# EAGLE design Variateur.sch (EAGLE 6.1)
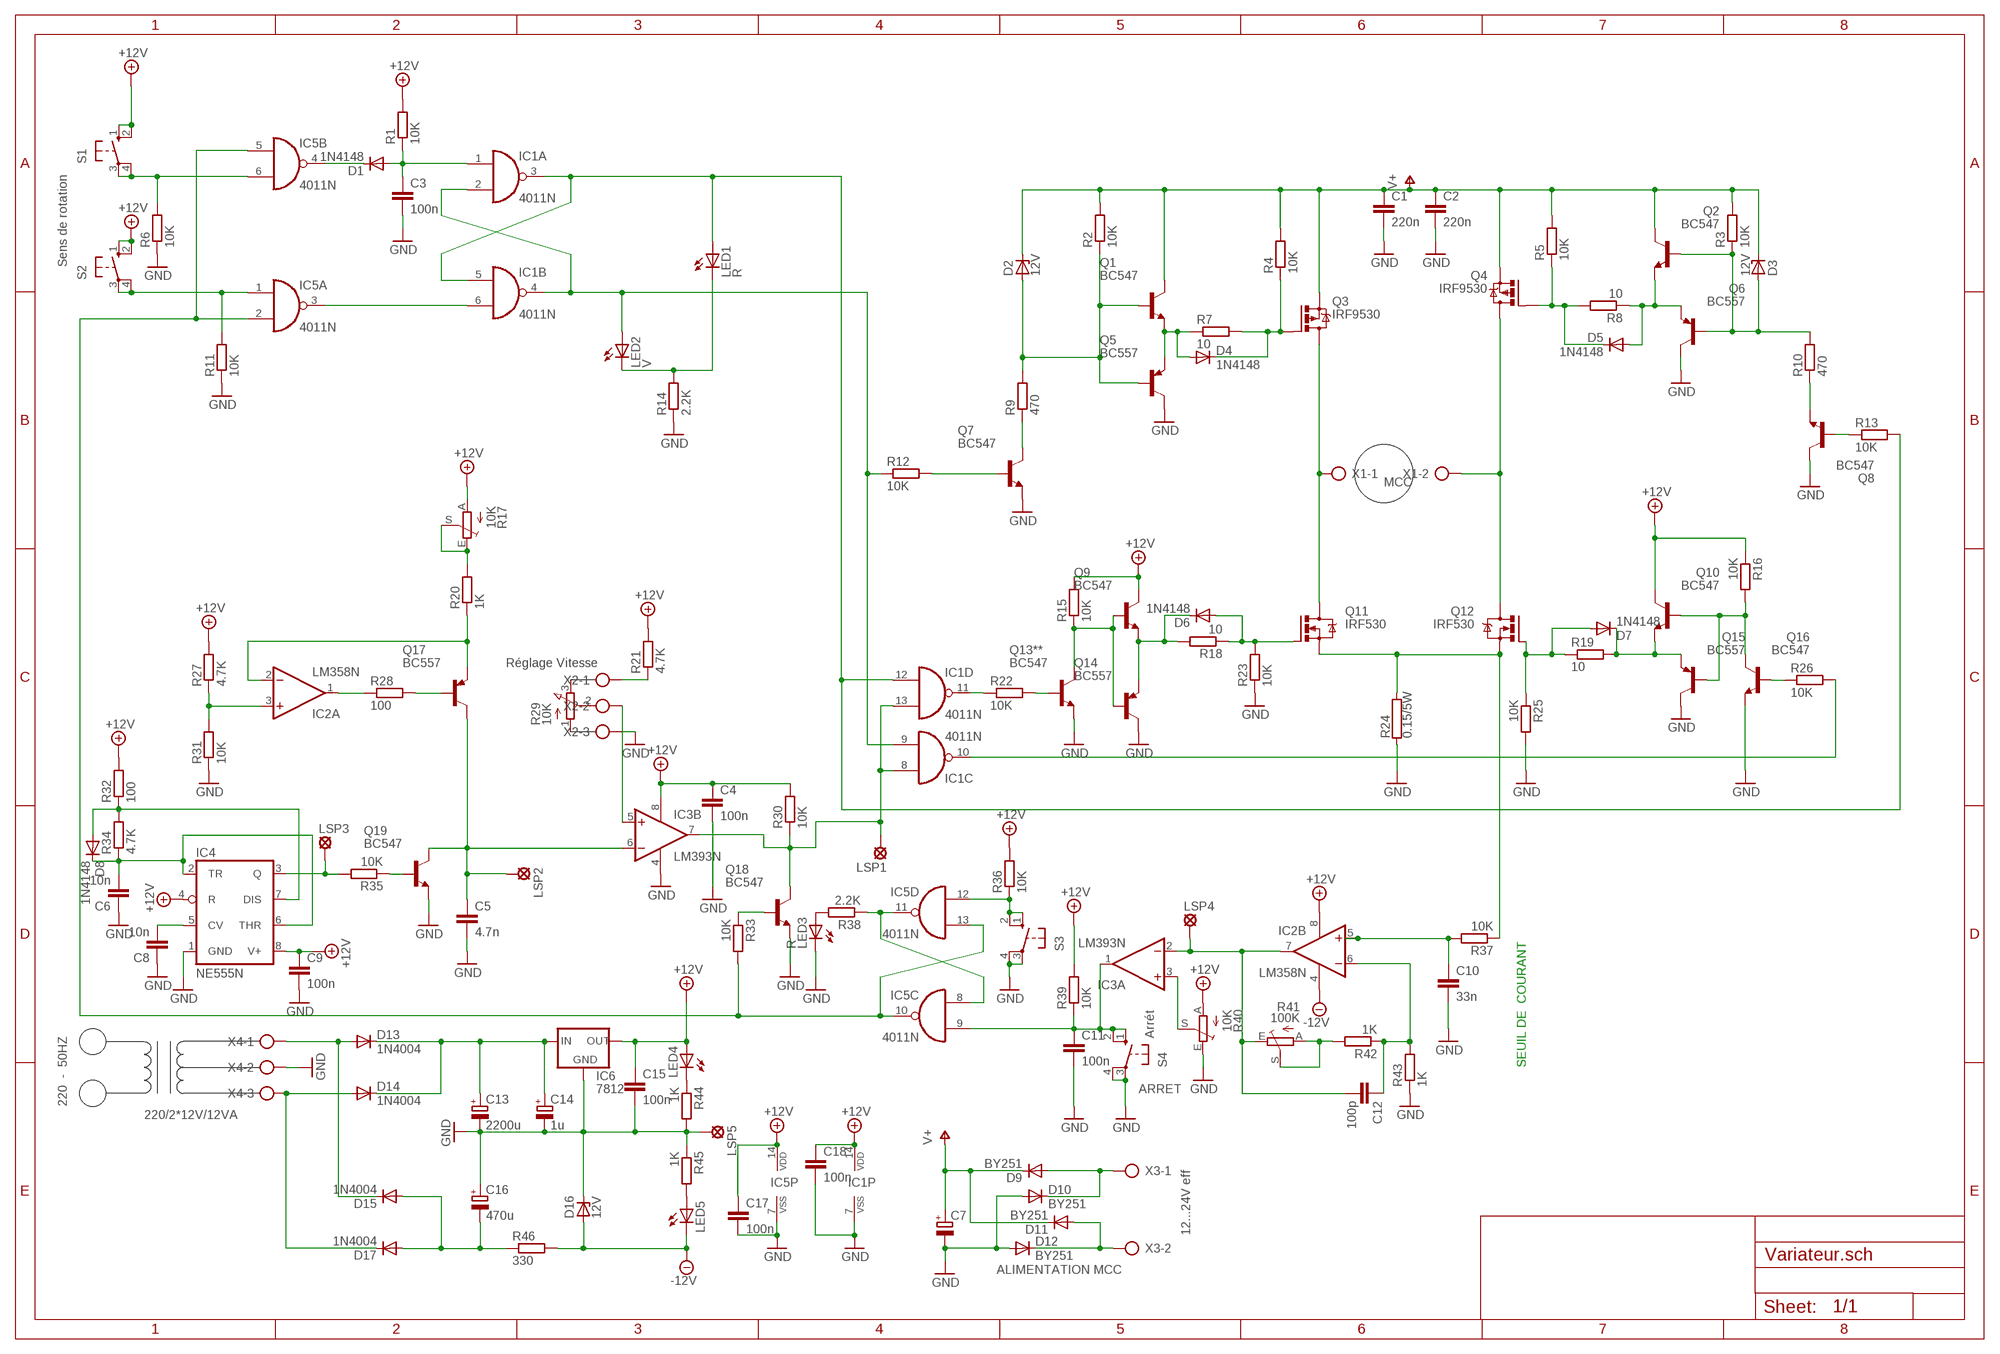
[diagram p0: schematic, sheet 1]

## Parts
C1  220n  C-EU150-064X183  [C150-064X183]
C2  220n  C-EU150-064X183  [C150-064X183]
C3  100n  C-EU050-035X075  [C050-035X075]
C4  100n  C-EU050-035X075  [C050-035X075]
C5  4.7n  C-EU050-035X075  [C050-035X075]
C6  10n  C-EU050-035X075  [C050-035X075]
C7  CPOL-EUE10-25  [EB25D]
C8  10n  C-EU050-035X075  [C050-035X075]
C9  100n  C-EU050-035X075  [C050-035X075]
C10  33n  C-EU050-035X075  [C050-035X075]
C11  100n  C-EU050-035X075  [C050-035X075]
C12  100p  C-EU050-035X075  [C050-035X075]
C13  2200u  CPOL-EUE5-13  [E5-13]
C14  1u  CPOL-EUE2.5-6  [E2,5-6]
C15  100n  C-EU050-035X075  [C050-035X075]
C16  470u  CPOL-EUE3.5-10  [E3,5-10]
C17  100n  C-EU050-035X075  [C050-035X075]
C18  100n  C-EU050-035X075  [C050-035X075]
D1  1N4148  1N4148DO35-10  [DO35-10]
D2  12V  BZX85  [DO41Z10]
D3  12V  BZX85  [DO41Z10]
D4  1N4148  1N4148DO35-10  [DO35-10]
D5  1N4148  1N4148DO35-10  [DO35-10]
D6  1N4148  1N4148DO35-10  [DO35-10]
D7  1N4148  1N4148DO35-10  [DO35-10]
D8  1N4148  1N4148DO35-10  [DO35-10]
D9  BY251  [DO201-15]
D10  BY251  [DO201-15]
D11  BY251  [DO201-15]
D12  BY251  [DO201-15]
D13  1N4004  [DO41-10]
D14  1N4004  [DO41-10]
D15  1N4004  [DO41-10]
D16  12V  BZX85  [DO41Z10]
D17  1N4004  [DO41-10]
IC1  4011N  [DIL14]
IC2  LM358N  [DIL08]
IC3  LM393N  [DIL08]
IC4  NE555N  [DIL08]
IC5  4011N  [DIL14]
IC6  7812  78XXS  [78XXS]
LED1  R  LED5MM  [LED5MM]
LED2  V  LED5MM  [LED5MM]
LED3  R  LED5MM  [LED5MM]
LED4  LED5MM  [LED5MM]
LED5  LED5MM  [LED5MM]
LSP1  LSP10  [LSP10]
LSP2  LSP10  [LSP10]
LSP3  LSP10  [LSP10]
LSP4  LSP10  [LSP10]
LSP5  LSP10  [LSP10]
Q1  BC547  [TO92]
Q2  BC547  [TO92]
Q3  IRF9530  [TO220BV]
Q4  IRF9530  [TO220BV]
Q5  BC557  [TO92-EBC]
Q6  BC557  [TO92]
Q7  BC547  [TO92]
Q8  BC547  [TO92]
Q9  BC547  [TO92]
Q10  BC547  [TO92]
Q11  IRF530  [TO220BV]
Q12  IRF530  [TO220BV]
Q13**  BC547  [TO92]
Q14  BC557  [TO92-EBC]
Q15  BC557  [TO92]
Q16  BC547  [TO92]
Q17  BC557  MPSA56-TO92  [TO92-CBE]
Q18  BC547  -NPN-TO92  [TO92]
Q19  BC547  -NPN-TO92  [TO92]
R1  10K  R-EU_0207/10  [0207/10]
R2  10K  R-EU_0207/10  [0207/10]
R3  10K  R-EU_0207/10  [0207/10]
R4  10K  R-EU_0207/10  [0207/10]
R5  10K  R-EU_0207/10  [0207/10]
R6  10K  R-EU_0207/10  [0207/10]
R7  10  R-EU_0207/10  [0207/10]
R8  10  R-EU_0207/10  [0207/10]
R9  470  R-EU_0207/10  [0207/10]
R10  470  R-EU_0207/10  [0207/10]
R11  10K  R-EU_0207/10  [0207/10]
R12  10K  R-EU_0207/15  [0207/15]
R13  10K  R-EU_0207/15  [0207/15]
R14  2.2K  R-EU_0207/15  [0207/15]
R15  10K  R-EU_0207/15  [0207/15]
R16  10K  R-EU_0207/10  [0207/10]
R17  10K  TRIM_EU-LI10  [LI10]
R18  10  R-EU_0207/10  [0207/10]
R19  10  R-EU_0207/10  [0207/10]
R20  1K  R-EU_0207/10  [0207/10]
R21  4.7K  R-EU_0207/10  [0207/10]
R22  10K  R-EU_0207/15  [0207/15]
R23  10K  R-EU_0207/10  [0207/10]
R24  0.15/5W  RHPS923  [HPS923]
R25  10K  R-EU_0207/10  [0207/10]
R26  10K  R-EU_0207/15  [0207/15]
R27  4.7K  R-EU_0207/10  [0207/10]
R28  100  R-EU_0207/10  [0207/10]
R29  10K  3RP/1610N  [3RP/1610N]
R30  10K  R-EU_0207/10  [0207/10]
R31  10K  R-EU_0207/10  [0207/10]
R32  100  R-EU_0207/10  [0207/10]
R33  10K  R-EU_0207/10  [0207/10]
R34  4.7K  R-EU_0207/10  [0207/10]
R35  10K  R-EU_0207/10  [0207/10]
R36  10K  R-EU_0207/10  [0207/10]
R37  10K  R-EU_0207/10  [0207/10]
R38  2.2K  R-EU_0207/10  [0207/10]
R39  10K  R-EU_0207/10  [0207/10]
R40  10K  TRIM_EU-LI10  [LI10]
R41  100K  TRIM_EU-LI10  [LI10]
R42  1K  R-EU_0207/10  [0207/10]
R43  1K  R-EU_0207/10  [0207/10]
R44  1K  R-EU_0207/10  [0207/10]
R45  1K  R-EU_0207/10  [0207/10]
R46  330  R-EU_0207/10  [0207/10]
S1  40-XX  [B3F-40XX]
S2  40-XX  [B3F-40XX]
S3  40-XX  [B3F-40XX]
S4  Arrét  40-XX  [B3F-40XX]
X1  AK300/2  [AK300/2]
X2  AK300/3  [AK300/3]
X3  AK300/2  [AK300/2]
X4  AK300/3  [AK300/3]

## Nets
+12V: C4.1 C9.1 C15.1 C17.1 C18.1 IC1.14(P:VDD) IC2.8(P:V+) IC3.8(P:V+) IC4.4(R) IC4.8(V+) IC5.14(P:VDD) IC6.OUT LED4.A Q9.3(C) Q10.3(C) R1.2 R15.2 R16.1 R17.A R21.2 R27.2 R30.2 R32.2 R36.2 R39.2 R40.A S1.1(S) S1.2(S1) S2.1(S) S2.2(S1)
-12V: D16.A IC2.4(P:V-) LED5.K(C) R46.2
D12: D11.A D12.C X3.2
GND: C1.2 C2.2 C3.2 C4.2 C5.2 C6.1 C7.- C8.1 C9.2 C10.2 C11.2 C13.- C14.- C15.2 C16.+ C17.2 C18.2 D10.A D12.A D16.C IC1.7(P:VSS) IC3.4(P:V-) IC4.1(GND) IC5.7(P:VSS) IC6.GND LED3.K(C) LSP5.MP Q5.C Q6.3(C) Q7.1(E) Q8.3(C) Q13**.1(E) Q14.C Q15.3(C) Q16.1(E) Q18.1(E) Q19.1(E) R6.1 R11.1 R14.1 R23.1 R24.1 R25.2 R31.1 R40.E R43.1 R44.2 R45.1 S3.3(P) S3.4(P1) S4.3(P) S4.4(P1) X2.3 X4.2
N$1: C8.2 IC4.5(CV)
N$2: D7.A Q12.G R19.1 R25.1
N$3: Q11.S Q12.S R24.2 R37.1
N$4: Q19.2(B) R35.1
N$5: D8.A IC4.7(DIS) R32.1 R34.2
N$6: D13.A D15.C X4.1
N$7: D14.A D17.C X4.3
N$8: LED4.K(C) R44.1
N$9: C6.2 D8.C IC4.2(TR) IC4.6(THR) R34.1
N$10: C13.+ C14.+ D13.C D14.C IC6.IN
N$12: C16.- D15.A D17.A R46.1
N$13: LED5.A R45.2
N$14: C5.1 IC3.6(B:-IN) LSP2.MP Q17.C Q19.3(C)
N$15: IC5.8(C:I0) IC5.11(D:O) R38.1
N$16: C12.2 IC2.7(B:OUT) IC3.2(A:-IN) LSP4.MP R41.E
N$17: R41.A R41.S R42.2
N$18: IC4.3(Q) LSP3.MP R35.2
N$19: R17.E R17.S R20.2
N$20: Q17.B R28.2
N$21: IC2.1(A:OUT) R28.1
N$22: IC2.3(A:+IN) R27.1 R31.2
N$23: LED3.A R38.2
N$24: IC2.2(A:-IN) Q17.E R20.1
N$25: IC5.2(A:I1) IC5.5(B:I0) IC5.10(C:O) IC5.13(D:I1) R33.2
N$27: IC3.5(B:+IN) X2.2
N$28: R21.1 X2.1
N$29: IC1.8(C:I0) IC1.13(D:I1) IC3.7(B:OUT) LSP1.MP Q18.3(C) R30.1
N$30: Q18.2(B) R33.1
N$31: IC5.12(D:I0) R36.1 S3.1(S) S3.2(S1)
N$33: C10.1 IC2.5(B:+IN) R37.2
N$34: C11.1 IC3.1(A:OUT) IC5.9(C:I1) R39.1 S4.1(S) S4.2(S1)
N$35: IC3.3(A:+IN) R40.S
N$37: Q8.1(E) R10.1
N$38: IC1.11(D:O) R22.1
N$39: Q13**.2(B) R22.2
N$40: IC1.10(C:O) R26.2
N$41: D6.C Q9.1(E) Q14.E R18.2
N$42: Q9.2(B) Q13**.3(C) Q14.B R15.1
N$43: D6.A Q11.G R18.1 R23.2
N$44: IC1.2(A:I1) IC1.4(B:O) IC1.9(C:I1) LED2.A R12.1
N$45: Q7.2(B) R12.2
N$46: Q7.3(C) R9.1
N$47: D2.A Q1.2(B) Q5.B R2.1 R9.2
N$48: D4.A Q1.1(E) Q5.E R7.1
N$50: Q3.D Q11.D X1.1
N$51: D4.C Q3.G R4.1 R7.2
N$57: Q4.D Q12.D X1.2
N$58: C12.1 IC2.6(B:-IN) R42.1 R43.2
N$59: D5.C Q4.G R5.1 R8.2
N$62: D7.C Q10.1(E) Q15.1(E) R19.2
N$63: Q16.2(B) R26.1
N$64: Q8.2(B) R13.1
N$65: IC1.3(A:O) IC1.5(B:I0) IC1.12(D:I0) LED1.A R13.2
N$66: Q10.2(B) Q15.2(B) Q16.3(C) R16.2
N$68: D3.A Q2.2(B) Q6.2(B) R3.1 R10.2
N$69: D5.A Q2.1(E) Q6.1(E) R8.1
N$71: LED1.K(C) LED2.K(C) R14.2
N$73: C3.1 D1.A IC1.1(A:I0) R1.1
N$74: IC1.6(B:I1) IC5.3(A:O)
N$75: D1.C IC5.4(B:O)
N$76: IC5.1(A:I0) R11.2 S2.3(P) S2.4(P1)
N$77: IC5.6(B:I1) R6.2 S1.3(P) S1.4(P1)
R: D9.A D10.C X3.1
V+: C1.1 C2.1 C7.+ D2.C D3.C D9.C D11.C Q1.3(C) Q2.3(C) Q3.S Q4.S R2.2 R3.2 R4.2 R5.2
Unconnected: R29.1(A) R29.2(S) R29.3(E)

## Notes on the sheet
- Sens de rotation
- MCC
- Réglage Vitesse
- SEUIL DE  COURANT
- ARRET
- 220  -  50HZ
- 220/2*12V/12VA
- 12...24V eff
- ALIMENTATION MCC

## Library data of the parts
C1-C4 C6 C8-C12 C15 C17 C18 = rcl:C-EU: CAPACITOR, European symbol
C5 = resistor:C-EU: CAPACITOR, European symbol
C7 C13 C14 C16 = rcl:CPOL-EU: POLARIZED CAPACITOR, European symbol
D1 D4-D8 = diode:1N4148: DIODE high speed (Philips)
D2 D3 D16 = diode:BZX85: Z DIODE
D9-D12 = diode:BY251: DIODE Si, 200 V, 3 A
D13-D15 D17 = diode:1N4004: DIODE general purpose rectifier, 1 A
IC1 IC5 = 40xx:4011: Quad 2-input NAND
IC2 = linear:LM358: OP AMP also LM158; LM258; LM2904 Source: http://cache.national.com/ds/LM/LM158.pdf
IC3 = linear:LM393: COMPARATOR
IC4 = linear:*555: TIMER
IC6 = v-reg:78XXS: VOLTAGE REGULATOR
LED1-LED5 = led:LED: LED OSRAM: - CHIPLED LG R971, LG N971, LY N971, LG Q971, LY Q971, LO R971, LY R971 LH N974, LH R974 LS Q976, LO Q976, LY Q976 LO Q996 - Hyper CHIPLED LW Q18S LB Q993, LB Q99A, LB R99A - SideLED LS A670, LO A670, LY A670, LG A670, LP A670 LB A673, LV A673, LT A673, LW A673 LH A674 LY A675 LS A676, LA A676, LO A676, LY A676, LW A676 LS A679, LY A679, LG A679 - Hyper Micro SIDELED® LS Y876, LA Y876, LO Y876, LY Y876 LT Y87S - SmartLED LW L88C, LW L88S LB L89C, LB L89S, LG L890 LS L89K, LO L89K, LY L89K LS L896, LA L896, LO L896, LY L896 - TOPLED LS T670, LO T670, LY T670, LG T670, LP T670 LSG T670, LSP T670, LSY T670, LOP T670, LYG T670 LG T671, LOG T671, LSG T671 LB T673, LV T673, LT T673, LW T673 LH T674 LS T676, LA T676, LO T676, LY T676, LB T676, LH T676, LSB T676, LW T676 LB T67C, LV T67C, LT T67C, LS T67K, LO T67K, LY T67K, LW E67C LS E67B, LA E67B, LO E67B, LY E67B, LB E67C, LV E67C, LT E67C LW T67C LS T679, LY T679, LG T679 LS T770, LO T770, LY T770, LG T770, LP T770 LB T773, LV T773, LT T773, LW T773 LH T774 LS E675, LA E675, LY E675, LS T675 LS T776, LA T776, LO T776, LY T776, LB T776 LHGB T686 LT T68C, LB T68C - Hyper Mini TOPLED® LB M676 - Mini TOPLED Santana® LG M470 LS M47K, LO M47K, LY M47K Source: http://www.osram.convergy.de LUXEON: - LUMILED® LXK2-PW12-R00, LXK2-PW12-S00, LXK2-PW14-U00, LXK2-PW14-V00 LXK2-PM12-R00, LXK2-PM12-S00, LXK2-PM14-U00 LXK2-PE12-Q00, LXK2-PE12-R00, LXK2-PE12-S00, LXK2-PE14-T00, LXK2-PE14-U00 LXK2-PB12-K00, LXK2-PB12-L00, LXK2-PB12-M00, LXK2-PB14-N00, LXK2-PB14-P00, LXK2-PB14-Q00 LXK2-PR12-L00, LXK2-PR12-M00, LXK2-PR14-Q00, LXK2-PR14-R00 LXK2-PD12-Q00, LXK2-PD12-R00, LXK2-PD12-S00 LXK2-PH12-R00, LXK2-PH12-S00 LXK2-PL12-P00, LXK2-PL12-Q00, LXK2-PL12-R00 Source: www.luxeon.com KINGBRIGHT: KA-3528ASYC Source: www.kingbright.com
LSP1-LSP5 = solpad:LSP10: SOLDER PAD drill 1.0 mm, distributor Buerklin, 12H555
Q1 Q2 Q7-Q9 Q13** = transistor-npn:BC547*: NPN Transistor
Q3 Q4 = transistor-power:IRF9530: P-CHANNEL HEXFET POWER-MOS-FET Source: http://www.irf.com/product-info/datasheets/data/irf9530.pdf
Q5 Q14 = transistor-pnp:BC557*: PNP Transistror
Q6 Q15 = transistor-pnp:BC557: PNP Transistor
Q10 Q16 = transistor-neu-to92:BC547: NPN TRANSISTOR
Q11 Q12 = transistor-power:IRF530: HEXFET Power MOSFET
Q17 = transistor-pnp:*-?: PNP Transistor
Q18 Q19 = transistor-neu-to92:*-NPN-: NPN Transistror
R1-R16 R18-R23 R25-R28 R30-R39 R42-R46 = rcl:R-EU_: RESISTOR, European symbol
R17 R40 R41 = pot:TRIM_EU-: POTENTIOMETER
R24 = resistor-power:R: Power Resitor; OC_FARNELL: unknown; OC_NEWARK: unknown
R29 = pot:3RP/1610N: 16mm Potentiometer one level Source: http://www.alphapotentiometers.net/html/16mm_pot_2.html
S1-S4 = switch-omron:40-XX: OMRON SWITCH; MF: OMRON COMPONENTS USA; MPN: B3F-4000; OC_FARNELL: 176434; OC_NEWARK: 36K3105
X1 X3 = con-ptr500:AK300/2: CONNECTOR; OC_FARNELL: unknown; OC_NEWARK: unknown
X2 X4 = con-ptr500:AK300/3: CONNECTOR; OC_FARNELL: unknown; OC_NEWARK: unknown

## Board
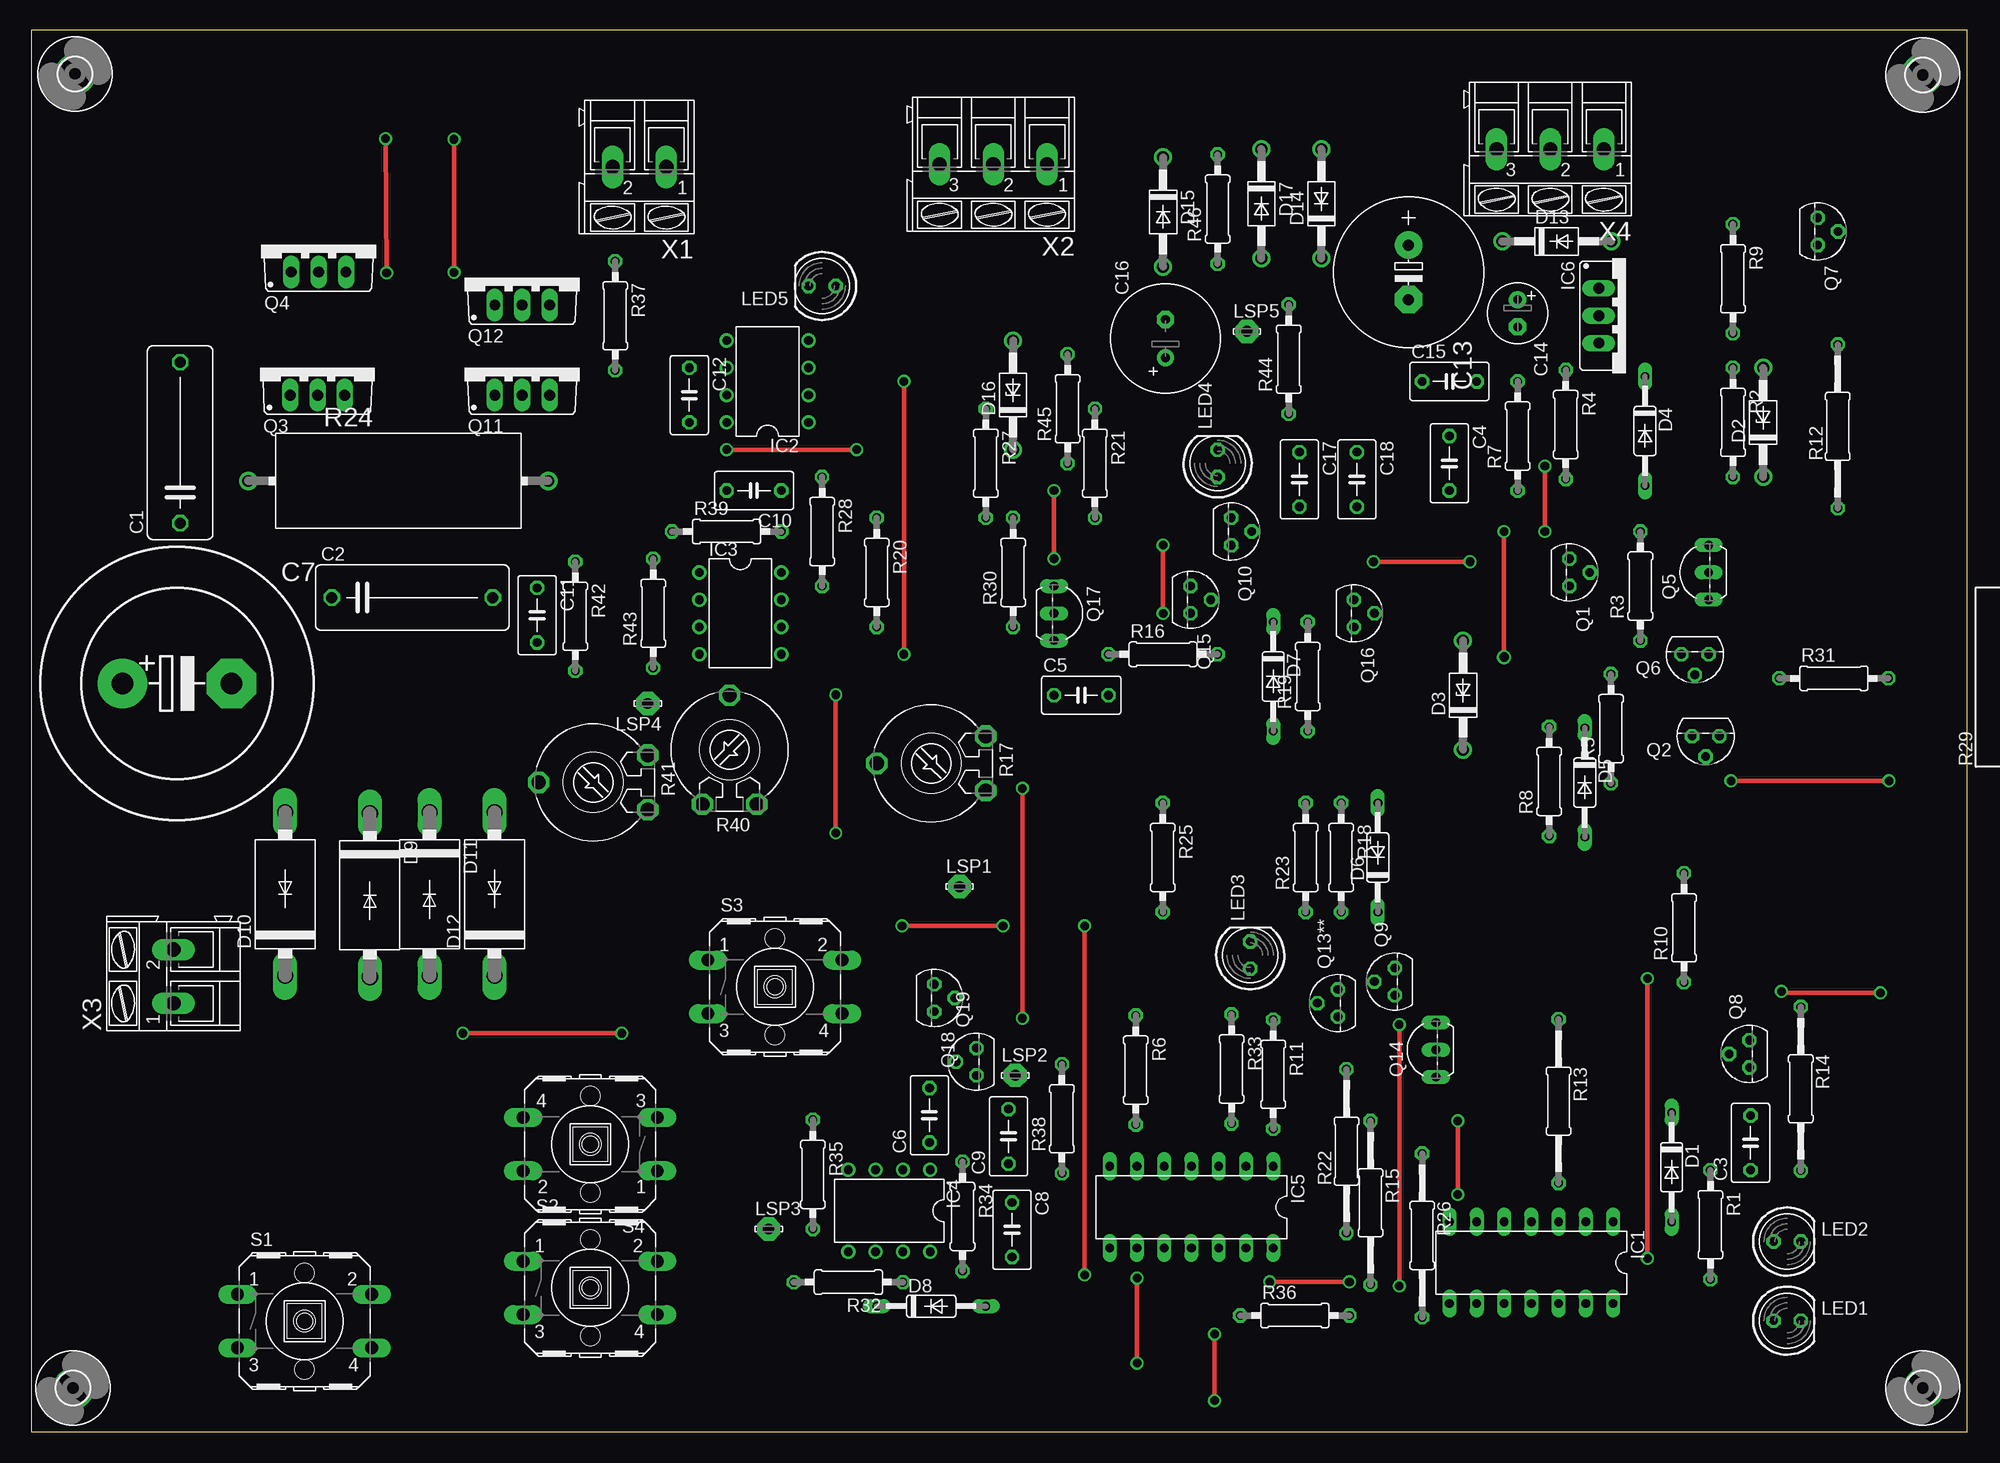
[diagram p1: board, top side]
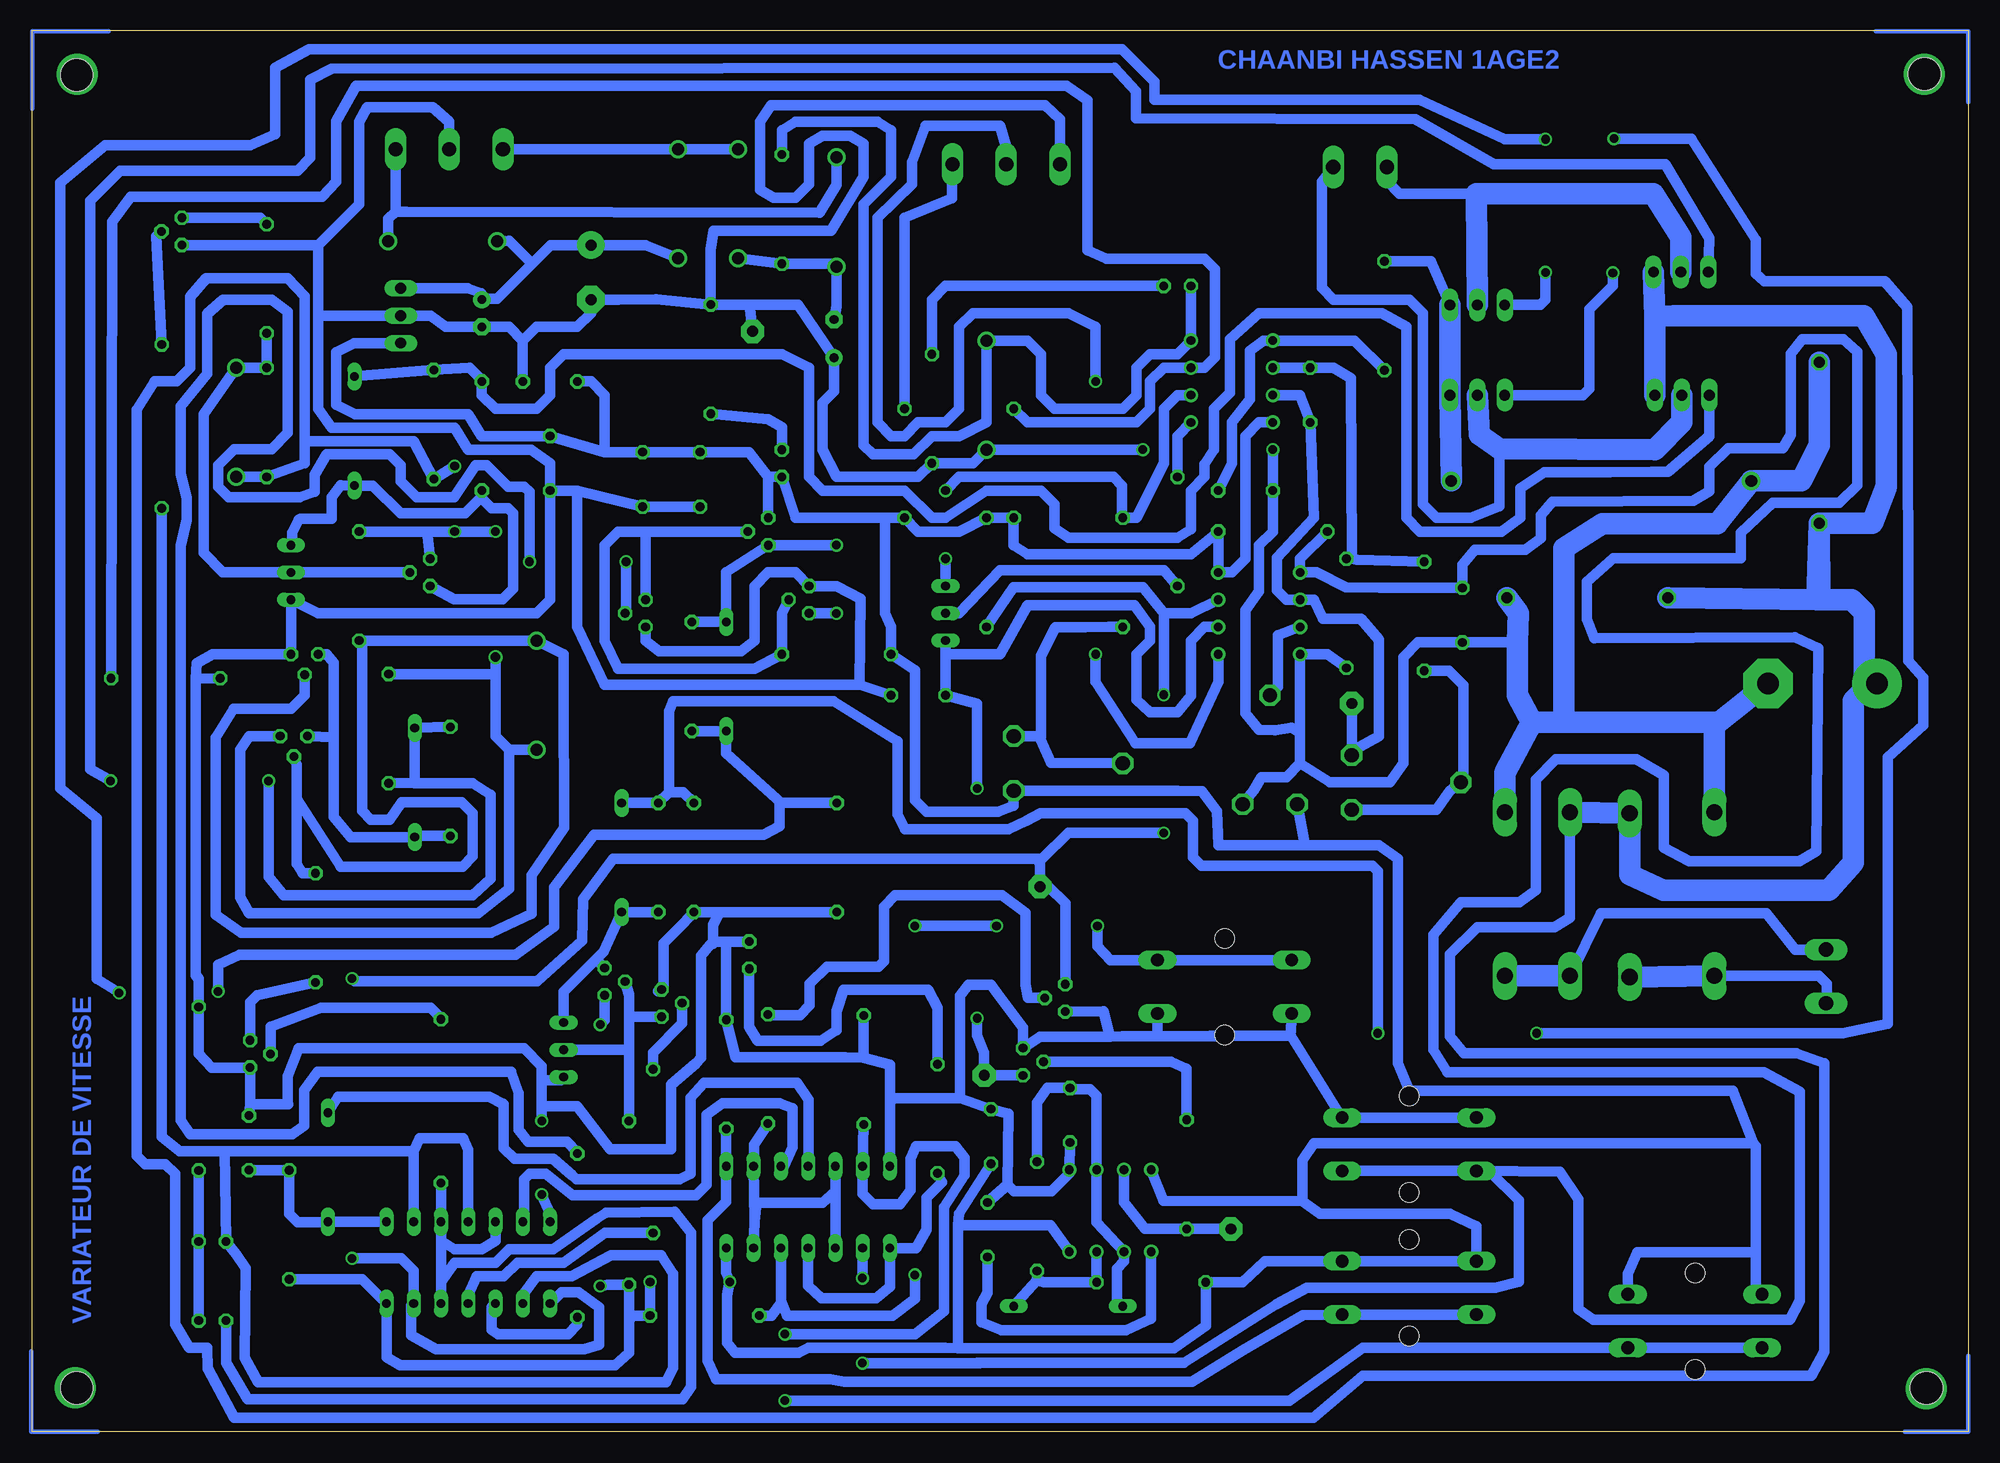
[diagram p2: board, bottom side, seen from below]

Size 180.32 x 130.48 mm. Coordinates in mm from the lower left corner, seen from the top.
Outline: 0,0 180.32,0 180.32,130.48 0,130.48 0,0
Copper layers (1*16): Top 0.035mm / dielectric 1.5mm / Bottom 0.035mm
Design rules: minimum track width 10mil, minimum drill 24mil, track to track 8mil, track to pad 8mil, pad to pad 8mil, via to via 8mil, smd to smd 8mil, copper to edge 40mil, drill to drill 8mil, minimum pad ring 10mil, minimum via ring 8mil, stop-mask expansion 4mil, vias tented up to drill 0mil, thermal gap 10mil

### Footprints (pad centres in the part's own frame; a part is rotated, then mirrored left to right if it is on the bottom)
C150-064X183 = drill 1.016 octagon: 1 -7.493,0; 2 7.493,0
C050-035X075 = drill 0.813 octagon: 1 -2.54,0; 2 2.54,0
EB25D = drill 2.007 pad 4.597: + -5.08,0 | drill 2.007 pad 4.597 octagon: - 5.08,0
E5-13 = drill 1.016 pad 2.54: + -2.54,0 | drill 1.016 pad 2.54 octagon: - 2.54,0
E2,5-6 = drill 0.813 pad 1.6: + -1.27,0 | drill 0.813 pad 1.6 octagon: - 1.27,0
E3,5-10 = drill 0.813 pad 1.6: + -1.778,0 | drill 0.813 pad 1.6 octagon: - 1.778,0
DO35-10 = drill 0.813 long: A 5.08,0; C -5.08,0
DO41Z10 = drill 1.118: A 5.08,0; C -5.08,0
DO201-15 = drill 1.499 long: A 7.62,0; C -7.62,0
DO41-10 = drill 1.118: A 5.08,0; C -5.08,0
DIL14 = drill 0.813 long: 1 -7.62,-3.81; 2 -5.08,-3.81; 3 -2.54,-3.81; 4 0,-3.81; 5 2.54,-3.81; 6 5.08,-3.81; 7 7.62,-3.81; 8 7.62,3.81; 9 5.08,3.81; 10 2.54,3.81; 11 0,3.81; 12 -2.54,3.81; 13 -5.08,3.81; 14 -7.62,3.81
DIL08 = drill 0.813 pad 1.27: 1 -3.81,-3.81; 2 -1.27,-3.81; 3 1.27,-3.81; 4 3.81,-3.81; 5 3.81,3.81; 6 1.27,3.81; 7 -1.27,3.81; 8 -3.81,3.81
78XXS = drill 1.016 long: GND 0,-2.54; IN -2.54,-2.54; OUT 2.54,-2.54
LED5MM = drill 0.813 octagon: A -1.27,0; K 1.27,0
LSP10 = drill 1.016 pad 2.159 octagon: MP 0,0
TO92 = drill 0.813 octagon: 1 1.27,0; 2 0,1.905; 3 -1.27,0
TO220BV = drill 1.016 long: D 0,-2.54; G -2.54,-2.54; S 2.54,-2.54
TO92-EBC = drill 0.813 long: B 0,-1.27; C -2.54,-1.27; E 2.54,-1.27
TO92-CBE = drill 0.813 long: B 0,0; C 2.54,0; E -2.54,0
0207/10 = drill 0.813 octagon: 1 -5.08,0; 2 5.08,0
0207/15 = drill 0.813 octagon: 1 -7.62,0; 2 7.62,0
LI10 = drill 1.321 octagon: A -2.54,-5.08; E 2.54,-5.08; S 0,5.08
HPS923 = drill 1.1 pad 1.7: 1 -13.97,0; 2 13.97,0
3RP/1610N = drill 1.2 pad 2.184: 1 -5,0; 2 0,0; 3 5,0
B3F-40XX = drill 1.194 long: 1 -6.248,2.489; 2 6.248,2.489; 3 -6.248,-2.489; 4 6.248,-2.489 | hole 1.803: 0,-4.496; 0,4.496
3,0 = hole 3: 0,0
AK300/2 = drill 1.321 long: 1 -2.515,0; 2 2.489,0
AK300/3 = drill 1.321 long: 1 -5.004,0; 2 0,0; 3 5.004,0

### Placement (x,y rotation side)
C1  13.87,92.09 90 top
C2  35.49,77.67 0 top
C3  160.12,26.9 90 top
C4  132.08,90.17 270 top
C5  97.79,68.58 0 top
C6  83.65,29.47 90 top
C7  13.57,69.67 0 top
C8  91.34,18.81 270 top
C9  91.01,27.5 90 top
C10  67.31,87.63 180 top
C11  47.12,76.03 270 top
C12  61.29,96.52 270 top
C13  128.27,107.95 270 top
C14  138.43,104.14 270 top
C15  132.08,97.79 0 top
C16  105.64,101.78 90 top
C17  118.11,88.67 270 top
C18  123.46,88.67 270 top
D1  152.77,24.63 270 top
D2  161.29,93.98 90 top
D3  133.35,68.58 90 top
D4  150.29,93.18 270 top
D5  144.68,60.45 270 top
D6  125.41,53.47 90 top
D7  115.67,70.32 270 top
D8  83.82,11.69 0 top
D9  31.54,49.96 270 top
D10  23.65,50.06 90 top
D11  37.09,50.06 270 top
D12  43.15,50.06 90 top
D13  142.07,110.83 0 top
D14  120.15,114.34 90 top
D15  105.41,113.57 270 top
D16  91.44,96.52 90 top
D17  114.57,114.34 270 top
IC1  139.7,15.74 180 top
IC2  68.58,97.79 90 top
IC3  66.04,76.2 270 top
IC4  79.91,20.58 180 top
IC5  108.05,20.91 180 top
IC6  148.52,103.91 270 top
LED1  163.53,10.35 0 top
LED2  163.53,17.71 0 top
LED3  113.53,44.37 90 top
LED4  110.49,90.17 90 top
LED5  73.66,106.68 180 top
LSP1  86.46,50.76 0 top
LSP2  91.64,33.18 0 top
LSP3  68.68,18.88 0 top
LSP4  57.42,67.81 180 top
LSP5  113.22,102.45 0 top
Q1  143.24,80.01 270 top
Q2  155.94,64.77 180 top
Q3  26.67,99.06 0 top
Q4  26.77,110.52 0 top
Q5  154.94,80.01 90 top
Q6  154.94,72.39 180 top
Q7  166.37,111.76 270 top
Q8  160.02,35.18 90 top
Q9  127,41.91 90 top
Q10  111.76,83.82 270 top
Q11  45.72,99.06 0 top
Q12  45.72,107.45 0 top
Q13**  121.69,39.91 90 top
Q14  129.54,35.56 90 top
Q15  107.95,77.47 270 top
Q16  123.19,76.2 270 top
Q17  95.25,76.2 270 top
Q18  84.1,40.39 270 top
Q19  88.03,34.45 90 top
R1  156.38,19.27 270 top
R2  158.48,93.98 270 top
R3  149.86,78.74 90 top
R4  142.91,93.78 270 top
R5  147.12,65.47 90 top
R6  102.87,33.68 270 top
R7  138.43,92.71 90 top
R8  141.37,60.55 90 top
R9  158.48,107.35 270 top
R10  153.92,46.92 90 top
R11  115.67,33.28 270 top
R12  168.24,93.61 90 top
R13  142.24,30.78 270 top
R14  164.8,31.94 270 top
R15  124.73,21.32 270 top
R16  105.41,72.39 0 top
R17  83.82,62.23 90 top
R18  122,53.47 270 top
R19  118.88,70.32 90 top
R20  78.74,80.01 270 top
R21  99.06,90.17 270 top
R22  122.49,26.13 90 top
R23  118.69,53.47 90 top
R24  34.19,88.53 0 top
R25  105.38,53.47 270 top
R26  129.54,18.28 270 top
R27  88.9,90.17 270 top
R28  73.66,83.82 270 top
R29  186.5,70.25 90 top  (outside the outline)
R30  91.44,80.01 90 top
R31  167.88,70.15 0 top
R32  76.1,13.93 180 top
R33  111.79,33.78 270 top
R34  86.73,20.05 270 top
R35  72.79,23.96 270 top
R36  117.68,10.82 0 top
R37  54.38,103.91 270 top
R38  95.99,29.14 90 top
R39  64.77,83.82 0 top
R40  65.04,63.5 0 top
R41  52.34,60.46 90 top
R42  50.67,75.93 270 top
R43  57.92,76.2 90 top
R44  117.11,99.87 90 top
R45  96.52,95.25 90 top
R46  110.49,113.84 90 top
S1  25.46,10.3 0 top
S2  52.07,13.4 0 top
S3  69.26,41.43 0 top
S4  52.07,26.77 180 top
U$1  [3,0]  176.16,4.08 0 top
U$2  [3,0]  176.16,126.33 0 top
U$3  [3,0]  4.08,126.43 0 top
U$4  [3,0]  3.88,4.08 0 top
X1  56.63,117.75 180 top
X2  89.6,118.01 180 top
X3  13.25,42.41 90 top
X4  141.47,119.42 180 top

### Tracks (layer width: path | path; a pad name or v marks a point on that pad's centre or on a via)
+12V  (via drill 0.8, 0.8 pad 0.4, 0.8 pad 1)
  Top 0.406: v115.34,13.96 v122.76,13.96 | v127.4,13.57 v127.4,37.9
  Bottom 1: 124.73,10.4 R15.2 126.73,13.7 v127.4,13.57 | 124.73,10.4 124.73,7.35 126,6.18 146.05,6.18 147.32,6.95 IC1.14 149.58,14.19 R1.2 | IC4.8 85.49,19.21 94.08,19.21 | IC2.8 66.04,93.98 67.31,92.71 67.31,81.28 68.58,80.01 IC3.8 R39.2 72.39,81.68 87.63,81.68 88.9,82.55 R27.2 R30.2 93.98,83.82 97.79,83.82 R21.2 100.9,85.09 | 94.08,7.78 73.96,7.78 71.02,9.85 R32.2 67.58,13.93 65.52,15.89 S2.2 S2.1 45.82,19.15 48.26,20.32 60.36,20.32 62,21.46 | 94.08,19.21 94.08,7.78 | IC6.OUT 150.33,101.37 152,100.5 152,95.62 150.23,94.75 139.7,94.75 138.43,92.71 C4.1 127,91.21 | 127,91.21 C18.1 C17.1 113.53,91.21 111.76,88.9 | C15.1 128.27,97.79 127,96.52 127,91.21 | Q10.3 111.76,88.9 | 111.76,88.9 LED4.A 109.22,85.09 100.9,85.09 | R40.A 61.77,54.61 | 61.77,54.61 69.85,54.61 69.99,57.78 71.39,59.65 73.66,59.69 R17.A 88.9,58.28 90.37,57.71 97.02,57.71 98.09,58.78 98.09,70.92 R16.1 100.33,74.93 100.9,76.2 100.9,85.09 | C9.1 93.98,20.32 94.08,19.21 | v122.76,13.96 R36.2 124.35,10.82 124.73,10.4 | 61.77,54.61 54.88,54.61 53.11,53.34 53.11,34.29 52.07,31.75 41.78,31.75 21.95,31.77 20,26.87 | 62,21.46 62,25.3 60.93,26.87 20,26.87 | 62,21.46 74.97,21.49 IC4.4 | 94.08,7.78 95.3,7.8 108,7.8 108.96,7.34 114.84,7.34 115.6,8.3 115.6,12.72 v115.34,13.96 115.67,14.83 IC5.14 | S1.2 31.71,14.69 30.8,16.7 19.8,16.7 | S1.1 19.79,13.29 19.8,14.9 19.8,16.7 | 19.8,16.7 19.8,26.57 20,26.87 | Q9.3 127,38.3 v127.4,37.9
-12V
  Bottom 1: LED5.K IC2.4 73.66,100.33 76.2,100.33 77.47,99.06 77.47,96.52 78.74,95.25 85.09,95.25 86.36,96.52 86.36,100.33 87.63,101.6 D16.A 91.44,93.98 93.98,92.71 96.52,92.71 98.23,91 102,91 102.87,91.87 102.87,114.3 100.33,116.84 100.33,121.19 101.6,121.96 109.22,121.96 110.49,121.19 R46.2
D12
  Bottom 1: X3.2 16.1,44.9 18.8,48.3 34.2,48.3 37.1,42.4 D11.A
  Bottom 2: D11.A D12.C
GND  (via drill 0.8, 0.8 pad 1)
  Top 0.406: v132.85,22.09 v132.85,28.94 | v76.87,91.44 v64.77,91.44
  Bottom 1: 89.47,22.99 C8.1 | 62.23,65.04 62.23,62.23 | 62.23,62.23 63.5,60.96 65.81,60.96 66.58,59.69 R40.E | 62.23,65.04 IC3.4 59.69,72.39 R43.1 | 62.23,65.04 63.04,65.54 64.58,65.31 66.08,65.35 67.31,66.89 67.31,76.47 66.04,78.24 66.04,82.55 64.77,83.82 C10.2 v64.77,91.44 | C6.1 IC4.1 83.72,24.08 85.4,22.4 88.88,22.4 89.47,22.99 | 160.02,30.48 Q8.3 163.61,33.91 164.8,35.2 R14.1 164.8,42.2 165.1,42.5 165.1,69.32 165.09,70.13 | 160.02,30.48 C3.2 | 132.85,32.75 132.85,30.31 | 132.85,30.31 129.54,30.31 126.5,26.3 120.8,26.3 120.8,32.3 118.5,34.3 118,34.8 118,44.3 117.16,45.34 116.8,45.64 | 116.31,48.39 R23.1 120.19,46.81 121.5,45.5 121.5,41.5 121.69,41.31 | 115.68,45.64 LED3.K | 115.68,45.64 R11.1 114.8,34.85 104.61,34.85 102.87,34.82 | C4.2 132.08,77.47 133.35,76.2 153.67,76.2 Q5.C Q6.3 161.91,72.39 163.5,72.4 165,71.55 165.09,70.13 | 134.62,101.6 135.89,102.87 C14.- 138.46,102.9 141.8,102.9 143.21,103.91 IC6.GND 153.67,103.91 | 134.62,101.6 C15.2 | Q7.1 153.67,110.49 | 153.67,110.49 153.67,103.91 | 129.54,87.63 C18.2 C17.2 | X4.2 141.47,121.96 143.01,123.33 149.09,123.33 149.86,121.96 149.86,114.3 153.67,110.49 | 134.62,101.6 133.35,102.87 129.54,102.87 128.27,104.14 C13.- 125.73,105.41 122.19,105.45 R44.2 | Q16.1 123.19,73.66 121.92,72.69 114.3,72.69 113.03,73.66 113.03,78.74 111.76,80.01 109.22,80.01 Q15.3 105.41,78.74 103.17,77.57 103.27,69.55 | 79.95,36.79 80.55,39.13 Q18.1 | 63.1,36.86 S4.3 S4.4 | 63.1,36.86 70.56,36.86 69.75,36.82 75.5,36.82 | 75.5,36.82 78.78,36.82 79.95,36.79 | 79.95,36.79 86.46,36.79 Q19.1 88.02,37.62 90.4,40.8 91,41.6 93.1,41.6 93.9,40.6 93.9,31.04
  Bottom 1: 42.01,73.49 C11.2 51.24,73.49 52.61,72.12 52.61,62.23 53.88,60.46 59.46,60.46 62.23,62.23 | C4.2 129.54,87.63 | 129.54,87.63 129.54,74.93 127,69.55 103.27,69.55 | 89.47,22.99 89.37,29.6 C9.2 93.9,31.04 | v132.85,28.94 132.85,30.31 | IC1.7 132.08,20.32 v132.85,22.09 | C4.2 132.08,90.17 133.85,91.44 139.7,91.44 140.97,93.48 152.4,93.48 153.67,95.25 153.67,103.91 | R44.2 117.11,110.03 116.84,111.8 105.91,111.8 102.87,116.84 102.87,119.92 104.14,120.69 106.68,120.69 107.95,119.92 107.95,116.15 109.22,114.88 111.26,114.88 112.53,115.65 112.53,121.97 111.5,123.5 86,123.5 84.6,122.2 84.6,120.51 X2.3 | 103.27,69.55 C5.2 | LSP5.MP 113.49,104.95 | 113.49,104.95 R44.2 | 113.49,104.95 109,104.94 C16.+ 105.64,96.87 106.68,95.83 106.68,91.44 105.41,88.9 97.79,88.9 R45.1 92.71,90.17 D16.C v76.87,91.44 | 160.02,30.48 156.48,30.48 156.5,30.5 156.5,33.1 155.5,35.7 134.5,35.7 132.85,34.05 132.85,32.75 | R6.1 102.87,34.82 | 132.85,32.75 131.08,32.75 Q14.C | 165.09,70.13 R31.1 | 122,41 121.69,41.31 | Q13**.1 121.69,41.31 | S3.3 63.11,36.85 63.1,36.86 | IC5.7 100.43,30.8 | 100.43,30.8 100.43,34.18 102.87,34.82 | 93.9,31.04 99.87,31.04 100.43,30.8 | S3.4 75.51,37.53 75.5,36.82 | 115.68,45.64 116.8,45.64 | R25.2 116.31,48.39 | 116.31,48.39 116.9,47.2 116.9,45.44 116.8,45.64
  Bottom 2: C1.2 13.87,91.87 15.54,88.53 R24.1 23.36,84.55 34.08,84.55 37.65,82.28 37.65,66.04 | D12.A 43.15,61.36 40.64,66.04 | 40.64,66.04 42.01,68.58 42.01,73.49 41.91,76.2 C2.2 | 23.65,65.73 23.76,66.04 37.65,66.04 | 23.65,65.73 D10.A | 23.65,65.73 C7.- | 37.65,66.04 40.64,66.04
N$1
  Bottom 1: IC4.5 76.1,10.5 78.45,9.45 90.05,9.45 91.9,10.2 91.9,11.9 91.34,12.96 C8.2
N$2  (via drill 0.8)
  Top 0.406: v39.37,107.95 v39.37,120.34 | v172.22,40.87 163.13,40.87 v163,41
  Bottom 1: R19.1 D7.A 115.67,63.19 110.51,58.52 | Q12.G 39.87,104.91 39.37,105.41 v39.37,107.95 | v39.37,120.34 43.18,120.34 51.1,124 75.8,124 75.8,125.7 78.8,128.7 154.5,128.7 157.7,127 157.7,120.8 160,119.8 173.5,119.8 177.7,116.3 177.7,59.9 174.3,57.1 174.3,42.19 v172.22,40.87 | v163,41 163,43.5 161,44.4 135.3,44.4 131.7,47 131.7,50.7 128,55.6 112.2,55.6 110.7,56.4 110.7,58.53 110.51,58.52 | R25.1 110.48,58.55 110.51,58.52
N$3
  Bottom 1: Q12.S 50.03,108.99 R37.1
  Bottom 2: R24.2 Q11.S Q12.S
N$4
  Bottom 1: R35.1 72.79,33.78 74.26,34.45 Q19.2
N$5
  Bottom 1: IC4.7 R32.1 86.06,13.93 86.73,14.1 | R34.2 86.73,14.1 | 86.73,14.1 D8.A
N$6
  Bottom 1: X4.1 146.47,113.6 | D15.C 105.41,116.09 107,113.5 145.47,113.6 146.47,113.6 | D13.A 147.15,112.92 146.47,113.6
N$7
  Bottom 1: X4.3 D14.A D17.C
N$8
  Bottom 1: R44.1 111.76,94.29 110.49,93.52 LED4.K
N$9
  Bottom 1: R34.1 86.73,30.64 85.76,32.01 C6.2 83.54,31.9 81.8,31.9 81.18,31.28 IC4.2 81.18,19.51 IC4.6 78.64,15.86 79.3,15.2 79.3,12.25 D8.C
N$10
  Bottom 1: D14.C 123.19,110.49 C13.+ 132.01,110.49 133.75,108.75 | IC6.IN 139.75,106.45 138.5,106 138.5,105.48 C14.+ 138.34,105.5 137,105.5 133.75,108.75 | D13.C 135.89,110.89 133.75,108.75
N$11  (via drill 0.5 pad 3.81)
  other vias: 3.9,4
N$12
  Bottom 1: D17.A R46.1 105.76,108.76 105.5,108.5 D15.A 105.41,104.79 C16.-
N$13
  Bottom 1: LED5.A 95.25,106.68 96.52,105.41 R45.2
N$14  (via drill 0.8)
  Top 0.406: v92.3,38.5 v92.3,59.9
  Bottom 1: Q19.3 LSP2.MP 91.66,35.3 92.3,36.9 v92.3,38.5 | v92.3,59.9 92.3,67.8 C5.1 95.25,72.39 | 95.25,72.39 Q17.C | 95.25,72.39 90.17,72.39 87.63,76.97 77.64,76.97 76.2,74.93 76.2,73.66 77.47,72.39 77.47,68.15 76.2,66.98 73.66,66.98 72.39,68.55 72.39,73.66 71.12,74.93 IC3.6
N$15
  Bottom 1: IC5.11 108.05,13.59 106.78,12.42 101.7,12.42 100.43,13.49 IC5.8 98,17.1 97,18.8 97,21.8 95.59,23.21 R38.1
N$16
  Bottom 1: IC2.7 62.23,96.52 C12.2 60.96,85.09 64.37,81.38 64.37,78.34 63.5,77.47 IC3.2 60.96,77.47 60.09,75.7 56.55,75.7 54.88,73.73 54.88,64.77 57.15,63.5 R41.E LSP4.MP
N$17
  Bottom 1: R41.A 49.53,57.92 48.26,59.69 R41.S 47.04,60.46 47,60.5 47,69.5 48.35,70.85 R42.2
N$18
  Bottom 1: IC4.3 78.64,21.35 76.67,18.88 R35.2 LSP3.MP
N$19
  Bottom 1: R17.S 85.44,62.3 86.41,64.47 86.36,64.77 | R17.E 86.36,64.77 | R20.2 80.01,74.93 82.25,74.9 84.99,74.9 86.36,72.23 86.36,64.77
N$20
  Bottom 1: R28.2 74.93,80.21 90.17,80.21 93.98,76.2 Q17.B
N$21
  Bottom 1: IC2.1 73.66,92.71 R28.1
N$22
  Bottom 1: R31.2 172.86,112.67 171.12,115.01 153.29,115.01 152,116.4 152,122 150.16,125.34 83.98,125.34 82.01,123.97 82.01,109.99 80.24,109.22 71.12,109.22 70.15,108.25 70.15,100.03 71.12,99.06 IC2.3 74.93,99.06 76.2,97.79 76.2,95.25 77.47,93.98 87.63,93.98 R27.1
N$23
  Bottom 1: R38.2 95.99,39.47 96.86,41.14 104.74,41.14 105.41,39.17 105.41,37.39 106.88,36.42 112.76,36.42 113.53,37.69 LED3.A
N$24  (via drill 0.8)
  Top 0.406: v95.25,81.28 v95.25,87.63
  Bottom 1: IC2.2 73.66,96.52 74.93,95.25 74.93,90.17 77.47,85.09 R20.1 78.7,85.1 78.8,85.2 78.8,88.1 79.6,88.9 93.98,88.9 v95.25,87.63 | Q17.E v95.25,81.28
N$25
  Bottom 1: 105.51,22.39 IC5.10 | 113.03,19.6 IC5.2 113.03,24.13 113.06,26.7 R33.2 | 113.03,19.6 IC5.13 | IC5.5 105.51,22.39 | 105.51,22.39 106.7,21.3 112.83,21.3 113.03,19.6
N$26  (via drill 0.5 pad 3.81)
  other vias: 176.3,4.1
N$27  (via drill 0.8)
  Top 0.406: v81.28,72.39 v81.28,97.79
  Bottom 1: X2.2 89.6,119.71 90.17,121.58 97.09,121.58 98.36,118.21 98.36,116.17 101.6,113.03 101.6,93.98 100.33,92.71 99.06,92.71 97.79,93.98 95.25,93.98 93.98,95.25 93.98,102.87 92.71,104.14 83.82,104.14 81.28,102.87 v81.28,97.79 | v81.28,72.39 81.28,69.85 77.54,64.11 72.49,64.11 69.85,69.85 IC3.5
N$28
  Bottom 1: X2.1 94.64,114.85 99.06,113.03 R21.1
N$29  (via drill 0.8)
  Top 0.406: v74.93,55.75 v74.93,68.62 | v150.53,42.2 v150.53,16.14
  Bottom 1: IC3.7 72.39,76.2 74.93,76.2 | 86.46,53 LSP1.MP 85.66,50.76 84.1,49.2 Q18.3 | 86.46,53 86.46,53.37 86.26,53.34 83.82,55.75 v74.93,55.75 | v74.93,68.62 74.93,76.2 | v150.53,16.14 145.95,16.14 144.78,14.97 IC1.13 145,11.71 145,9 142.7,7.7 128.9,7.7 127.5,8.1 127.5,11.6 129.4,13 131,13 IC1.8 | 74.93,76.2 76.87,78.64 88.9,78.64 R30.1 | 86.46,53 86.8,53.34 126.2,53.34 129.01,49.57 129.11,45.71 133.28,41.94 150.29,41.94 v150.53,42.2
N$30
  Bottom 1: Q18.2 87.56,40.4 87.8,41.63 87.8,48.32 89.97,49.96 99.94,49.96 101,48.9 101,43.8 101.5,43.3 106.3,43.3 107.9,41.7 107.9,39.7 108.8,38.8 111.73,38.8 R33.1
N$31  (via drill 0.8)
  Top 0.406: v98.1,14.6 v98.1,47.1 | v90.5,47.1 v81.1,47.1
  Bottom 1: 110.59,12.19 110.59,11.99 111.46,10.82 R36.1 | S3.1 S3.2 76.13,43.9 79.9,43.9 81.1,45.2 v81.1,47.1 | IC5.12 110.59,12.19 | 110.59,12.19 110,10.8 100.2,10.8 98.1,12.4 v98.1,14.6 | v98.1,47.1 v90.5,47.1
N$32  (via drill 0.5 pad 3.81)
  other vias: 176.1,126.4
N$33
  Bottom 1: C10.1 68.58,90.17 68.58,93.98 66.91,96.15 66.91,100.63 65.64,101.6 IC2.5 57.15,101.6 R37.2
N$34  (via drill 0.8, 0.8 pad 1)
  Top 0.406: v103,6.4 v103,14.3
  Bottom 1: R39.1 62.23,81.28 IC3.1 60.69,80.04 57.98,78.64 54.81,78.57 C11.1 47.12,80.74 45.95,82.11 41.23,82.11 39.79,83.18 39.79,85.32 38.75,86.59 25.6,86.69 24.13,87.56 24.13,89.83 22.36,91.57 17.28,91.57 16.51,92.84 16.51,100.35 15.44,101.72 11.63,101.72 10.36,100.55 10.36,88.14 12,86.5 18.19,86.5 18.2,86.51 21.19,83.71 21.19,81.31 33.04,81.31 35.51,79.14 35.51,75.65 34.84,73.88 16.18,73.98 13.97,72.97 14.17,54.07 15.74,53.1 25.99,53.1 28.36,54.37 28.36,61.12 30.9,62.63 38.43,62.63 40.27,60.72 40.27,50.44 41.81,49.3 47.26,49.3 49.8,46.26 49.8,35.56 48.49,33.49 19.04,33.49 15.67,31.65 15.67,12.19 16.64,10.42 34.93,10.42 36.3,11.39 36.3,21.66 38.02,24.23 S4.2 | S4.2 44.5,24.18 41.87,21.55 41.87,13.97 44.04,13.4 61.57,13.4 64.41,11.86 64.41,11.85 73.05,6.41 92.29,6.41 92.1,6.4 v103,6.4 | S4.1 S4.2 | IC5.9 102.97,17.13 v103,14.3
N$35
  Bottom 1: IC3.3 64.27,74.16 64.27,69.35 R40.S
N$36  (via drill 0.5 pad 3.81)
  other vias: 4.1,126.4
N$37
  Bottom 1: R10.1 159.36,40.64 160,40 160,37.31 Q8.1
N$38
  Bottom 1: IC1.11 139.7,12.7 138.93,14.47 136.39,14.47 135.12,15.74 130.84,15.74 126.97,18.51 R22.1
N$39
  Bottom 1: Q13**.2 119.78,38.02 122.5,35.3 122.5,33.7 122.49,33.71 R22.2
N$40
  Bottom 1: R26.2 129.54,9.96 130.4,9.1 136.9,9.1 137.5,9.5 137.5,11.59 IC1.10
N$41
  Bottom 1: R18.2 D6.C 127.11,44.69 127.81,43.99 | 127.81,43.99 Q9.1 | Q14.E 130.81,40.99 127.81,43.99
N$42
  Bottom 1: Q9.2 124.73,40.67 124.73,38.7 | Q14.B 124.73,35.56 | 124.73,35.56 124.73,38.7 | 124.73,35.56 R15.1 | Q13**.3 124.67,38.64 124.73,38.7
N$43  (via drill 0.8, 0.8 pad 0.81)
  Top 0.406: v55,37.1 v40.2,37.1 | v33,120.4 v33.1,107.9
  Bottom 1: D6.A R18.1 121,59.55 | v55,37.1 55,52.2 55.5,52.7 71.4,52.7 72.2,53.5 72.2,56.9 72.9,57.6 86.4,57.6 87.7,56.9 89.4,56.1 99,56.1 99.7,57.5 99.7,64.3 105.7,68 120.6,68 121,67.1 121,59.55 | v40.2,37.1 11.7,37.1 7.5,38 7.5,62.8 4.2,65.8 4.2,70.2 5.6,71.8 5.6,79.5 5.7,104.7 7.8,107.1 19,107.1 19.8,107.8 19.8,111 25.8,120.4 v33,120.4 | v33.1,107.9 33.1,106.7 35.3,104.5 35.3,97.1 35.9,96.5 43.2,96.5 Q11.G | 121,59.55 119.69,59.55 R23.2
N$44
  Bottom 1: IC1.4 139.7,26.27 140.17,27.34 144.22,27.34 144.78,26.1 | IC1.2 144.78,26.1 | 144.78,26.1 162.36,26.1 | 162.36,26.1 LED2.A 161.29,16.51 160.42,15.24 160.52,6.88 159.25,4.61 121.29,4.61 120.62,5.98 120.62,14.7 121.73,16.44 126.4,16.44 130.07,14.47 133.35,14.47 134.62,12.7 IC1.9 | R12.1 168.24,27.47 166.57,26.1 162.36,26.1
N$45
  Bottom 1: R12.2 168.74,111.3 Q7.2
N$46
  Bottom 1: Q7.3 159.08,113.03 R9.1
N$47
  Bottom 1: R9.2 R2.1 D2.A 164.33,94.75 164.33,81.82 162.56,80.01 Q5.B Q1.2
N$48
  Bottom 1: Q1.1 141,77.5 136.5,77.5 135.5,78.5 135.5,85.5 136,86 137.5,86 138.43,86.93 R7.1 138.43,87.07 140,85.5 146,85.5 148.59,88.09 D4.A 151.59,88.11 152.4,87 152.4,85 155.3,85 155.5,84.9 156.1,83.7 156.16,82.5 Q5.E
N$49
  Bottom 0.406: 173.2,130.4 180.3,130.4 180.3,123.2
N$50
  Bottom 1: 43.67,91.54 43.67,86.16 46.31,85.09 49.53,85.09 50.8,86.36 50.8,104.14 52.07,105.41 59.11,105.41 60.2,106.5 60.2,116.39 X1.1
  Bottom 2: Q11.D 45.52,92.84 43.67,91.54 29.21,91.44 26.67,93.98 Q3.D
N$51
  Bottom 1: D4.C R4.1 139.56,99.06 138.43,97.93 R7.2 138.43,96.52 137.16,95.25 133.35,95.25 132.08,96.52 132.08,99.06 130.81,100.33 110.49,100.33 107.95,99.06 107.95,88.9 106.68,87.63 99.06,87.63 96.52,85.09 95.25,85.09 91.44,87.63 86.36,87.63 85.09,86.36 85.09,84.12 83.82,83.25 73.66,83.25 72.39,84.02 72.39,87.63 71.12,88.9 71.12,90.07 70.25,91.44 70.25,95.25 68.78,96.72 68.78,101.7 66.04,104.14 54.61,104.14 52.34,102.87 52.34,85.09 51.07,83.82 43.5,83.82 41.73,85.09 41.73,87.86 39.49,89.33 33.38,89.33 29.47,89.37 28,89.37 24.13,92.71 Q3.G
N$52
  Bottom 0.406: 8.6,130.4 0,130.4 0,123.8
N$53
  Bottom 0.406: 5.9,0 0,0 0,7.1
N$54
  Bottom 0.406: 174.2,0 180.4,0 180.4,7.5
N$57
  Bottom 1: 45.82,115.26 52.96,115.28 54.14,116.46 X1.2
  Bottom 2: Q4.D 26.77,111.22 29.31,115.26 45.82,115.26 Q12.D
N$58
  Bottom 1: IC2.6 C12.1 59.12,99.06 57.48,98.09 57.38,81.28 | R43.2 57.38,81.28 | 57.38,81.28 56.94,81.18 R42.1
N$59  (via drill 0.8)
  Top 0.406: v158.3,60.6 v173,60.6
  Bottom 1: R8.2 D5.C 144.68,60.42 | Q4.G 24.13,111.13 28.2,118 44.2,118 51.5,122.2 77.5,122.3 77.5,124.8 79.5,127 152.4,126.9 154.4,125.9 154.4,118.6 155.6,117.4 172.1,117.4 174.9,114.6 174.9,61.7 v173,60.6 | v158.3,60.6 158.3,51.67 156.9,49.97 139.3,49.97 137.6,51.47 137.6,59.3 139.3,60.4 144.7,60.4 144.68,60.42 | R5.1 147.05,60.39 144.68,60.42
N$62  (via drill 0.8)
  Top 0.406: v105.41,76.2 v105.41,82.55
  Bottom 1: R19.2 D7.C 115.67,80.01 Q10.1 v105.41,82.55 | Q15.1 v105.41,76.2
N$63  (via drill 0.8)
  Top 0.406: v134,81 v125,81
  Bottom 1: R26.1 129.54,26.04 130.5,27 134.1,27 135,28.1 135,31.5 135.7,33.5 153.7,33.5 155,31.8 155,28.5 156.1,27.7 165.6,27.7 166.5,29 166.5,82.5 165.9,84.9 165.9,86.9 166.5,89.2 166.5,95.5 164,98.5 164,104.1 162.5,105.4 158,105.4 156.5,104.3 156.5,93 158,91.5 161.5,91.5 163,90 163,88 162,87 155.4,87 154,87.5 154,89.1 152.9,91 147,91 146,90 146,88.5 144.5,87 141,87 139,90 138,90 136,88 134.5,88 134,87.5 v134,81 | v125,81 125,76.3 Q16.2
N$64
  Bottom 1: R13.1 142.3,38.6 143.2,39.5 153.4,39.5 158.1,37.7 Q8.2
N$65
  Bottom 1: IC1.3 142.24,13.97 | IC1.3 142.24,17.78 140.97,17.01 138.43,17.01 137.16,17.78 IC1.5 | 142.24,13.97 140.97,15.74 137.16,15.74 135.89,17.01 131.81,17.01 127.73,19.82 126.87,20.4 120.5,20.5 118.95,18.55 118.95,4.21 119.72,3.04 160.22,3.04 162.26,6.41 LED1.A | 142.24,13.97 IC1.12 | R13.2 IC1.3
N$66
  Bottom 1: 123.19,83.82 125.73,83.82 127,82.55 127,73.66 125.73,71.02 113.03,71.02 R16.2 110.49,76.2 Q15.2 | 123.19,83.82 Q16.3 | Q10.2 123.19,83.82
N$68
  Bottom 1: Q6.2 154.94,68.58 156.21,67.31 161.56,67.31 163.23,64.64 163.23,48.12 160.86,46.45 137.59,46.45 133.82,48.22 133.82,51.82 130.78,56.26 130.78,58.49 130.81,66.96 130.81,72.39 D3.A R3.1 149.6,73.4 149.6,57.8 148.8,57 147,57 145.9,58.6 140.3,58.6 139.3,57.6 139.3,53.6 140.2,52.6 151.6,52.6 155.7,59 | 155.7,59 155.7,52.9 155.1,52 R10.2 | 155.7,59 155.7,62.12 Q2.2
N$69
  Bottom 1: Q2.1 152.23,64.67 | 152.23,64.67 152.23,57.24 150.66,55.37 D5.A 144.58,55.47 R8.1 | Q6.1 152.9,72.39 152.23,71.62 152.23,64.67
N$71
  Bottom 1: R14.2 LED2.K LED1.K
N$73
  Bottom 1: IC1.1 D1.A 152.77,19.57 152.8,19.6 | C3.1 156.44,24.36 | 156.44,24.36 156.4,24.4 | 156.44,24.36 156.43,24.35 R1.1 156.38,20.28 155.6,19.5 152.9,19.5 152.8,19.6 | 152.8,19.6 152.8,19.5
N$74
  Bottom 1: IC5.3 110.49,24.31 109.5,26.5 109.5,30.1 110.7,30.6 116,30.6 117.5,29.5 117.5,23 118.5,22 130,22 132.5,24 134,24 134.5,23.5 134.5,19.5 134.57,19.5 IC1.6
N$75
  Bottom 1: D1.C 151.83,31.18 137.76,31.18 136.39,30.51 136.39,30.01 136.4,30 | IC5.4 108,24.77 108,30.9 109.08,32.48 117.72,32.48 119,31.1 119,24 120,23.5 129.6,23.5 130.04,23.86 130.36,24.16 131.8,25.4 135.4,25.4 136.4,26.4 136.4,30 | 136.4,30 136.4,30.4 136.5,30.5 136.5,30.51 136.45,30.56
N$76
  Bottom 1: R11.2 IC5.1 115.7,24.69 115.7,21.4 117.4,19.7 117.4,6.6 116.6,4.9 106,4.9 104.64,4.64 72.32,4.64 67.55,7.58 61.95,10.84 S2.4 S2.3
N$77  (via drill 0.8)
  Top 0.406: v110.2,9.1 v110.2,2.9
  Bottom 1: R6.2 IC5.6 102.97,22.17 102,21.2 99.5,21.2 98.5,22.5 98.5,25.4 98,26.6 94.3,26.6 93.5,25.5 93.5,23.9 95.4,20.9 95.4,11.2 98.1,9.1 v110.2,9.1 | S1.3 S1.4 56.39,7.81 63.2,2.9 v110.2,2.9
R
  Bottom 1: D10.C 13.94,42.44 13.2,41.7 13.2,39.95 X3.1
  Bottom 2: D9.A D10.C
V+  (via drill 0.8, 0.8 pad 0.4, 0.88)
  Top 0.406: v140.97,89.9 v140.97,83.82 | v137.16,72.12 v137.16,83.82
  Bottom 1: 135.89,63.5 D3.C | 135.89,63.5 137.16,64.77 137.16,70.55 | 137.16,70.55 R5.2 | R3.2 143.51,83.82 | 143.51,83.82 Q1.3 | D2.C R2.2 154.94,90.17 154.94,92.21 | 154.94,92.21 144.78,92.21 R4.2 v140.97,89.9 | 135.89,63.5 135.89,50.56 138.76,48.29 160.09,48.29 160.96,49.76 160.96,63.5 160.09,64.77 Q2.3 | 143.51,83.82 v140.97,83.82 v137.16,83.82 | D11.C 37.09,47.86 38.56,46.99 45.72,46.99 48.26,44.45 48.26,36.83 46.99,35.26 16,35.26 13.43,34.29 13.43,7.47 14.6,5.2 56.4,5.2 61,1.3 161.5,1.3 163.9,5.8 163.97,5.87 164,7.8 165.7,7.8 167,10 167,24 167.9,24.9 169.8,24.9 170.58,25.68 170.58,95.15 168.91,97.79 166.87,97.79 165.6,99.06 165.6,105.67 164.09,107.41 156.51,107.41 154.94,105.74 154.94,92.21 | 137.16,70.55 v137.16,72.12
  Bottom 2: Q3.S 29.21,103.87 | 29.21,103.87 Q4.S | C2.1 14.1,77.47 C1.1 | C1.1 8.96,84.57 7.62,88.01 7.62,100.33 9.73,103.9 27.44,103.9 29.21,103.87 | D11.C D9.C 31.54,51.84 28.4,50.4 13,50.4 10.7,53 10.7,68.07 9.05,69.72 | C1.1 13.84,77.47 10.87,77.47 9.7,76.3 9.7,69.78 9.05,69.72 | 9.05,69.72 C7.+

### Text on the board
Bottom: CHAANBI HASSEN 1AGE2 | VARIATEUR DE VITESSE